# Altium schematic sheet LogicAnalyser.SchDoc
size A; Organization: Altium Limited; Address1: L3, 12a Rodborough Rd; Address2: Frenchs Forest; Address3: NSW; Address4: Australia 2086; DocumentNumber: 7; SheetNumber: 7; SheetTotal: 8
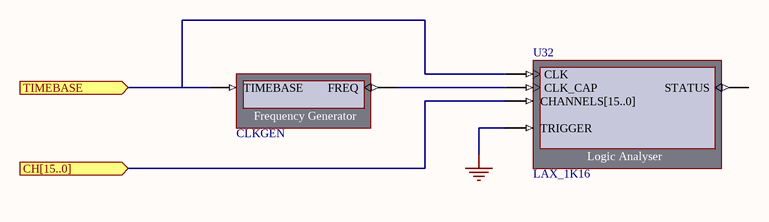
[diagram p0: LogicAnalyser.SchDoc]

## Parts
CLK_CAP  CLKGEN
U32  LAX_1K16

## Ports
CH[15..0] (in), TIMEBASE (in)

## Nets
GND: U32.TRIGGER
CH[15..0]: U32.CHANNELS[15..0] ; port CH[15..0]
TIMEBASE: CLK_CAP.TIMEBASE U32.CLK ; port TIMEBASE
NetCLK_CAP_FREQ: CLK_CAP.FREQ U32.CLK_CAP

Not connected (* = marked no-connect by the designer): U32 STATUS

## Notes on the sheet
- Title
- Size:
- Date:
- A
- Number:
- Time:
- Revision:
- Sheet
- of
- File:
- (in symbol LAX_1K16) Logic Analyser

## Library data of the parts
CLK_CAP = CLKGEN: Frequency Generator; NEXUS_CORE: Instrument; NEXUS_JTAG_DEVICE: True; NEXUS_JTAG_ORDER: 10; Published: 30/09/2003; Publisher: Altium Hobart Technology Centre; Core Revision: 1.00.00
U32 = LAX_1K16: Logic Analyser 1K16; NEXUS_CORE: Instrument; NEXUS_JTAG_DEVICE: True; NEXUS_JTAG_ORDER: 0; ChildModel1: RAM1KX16_LA16_1K; Published: 24/11/2003; Publisher: Altium Hobart Technology Centre; Core Revision: 1.00.00